# EAGLE design IO_board-ha-v4 (EAGLE 6.5.0)
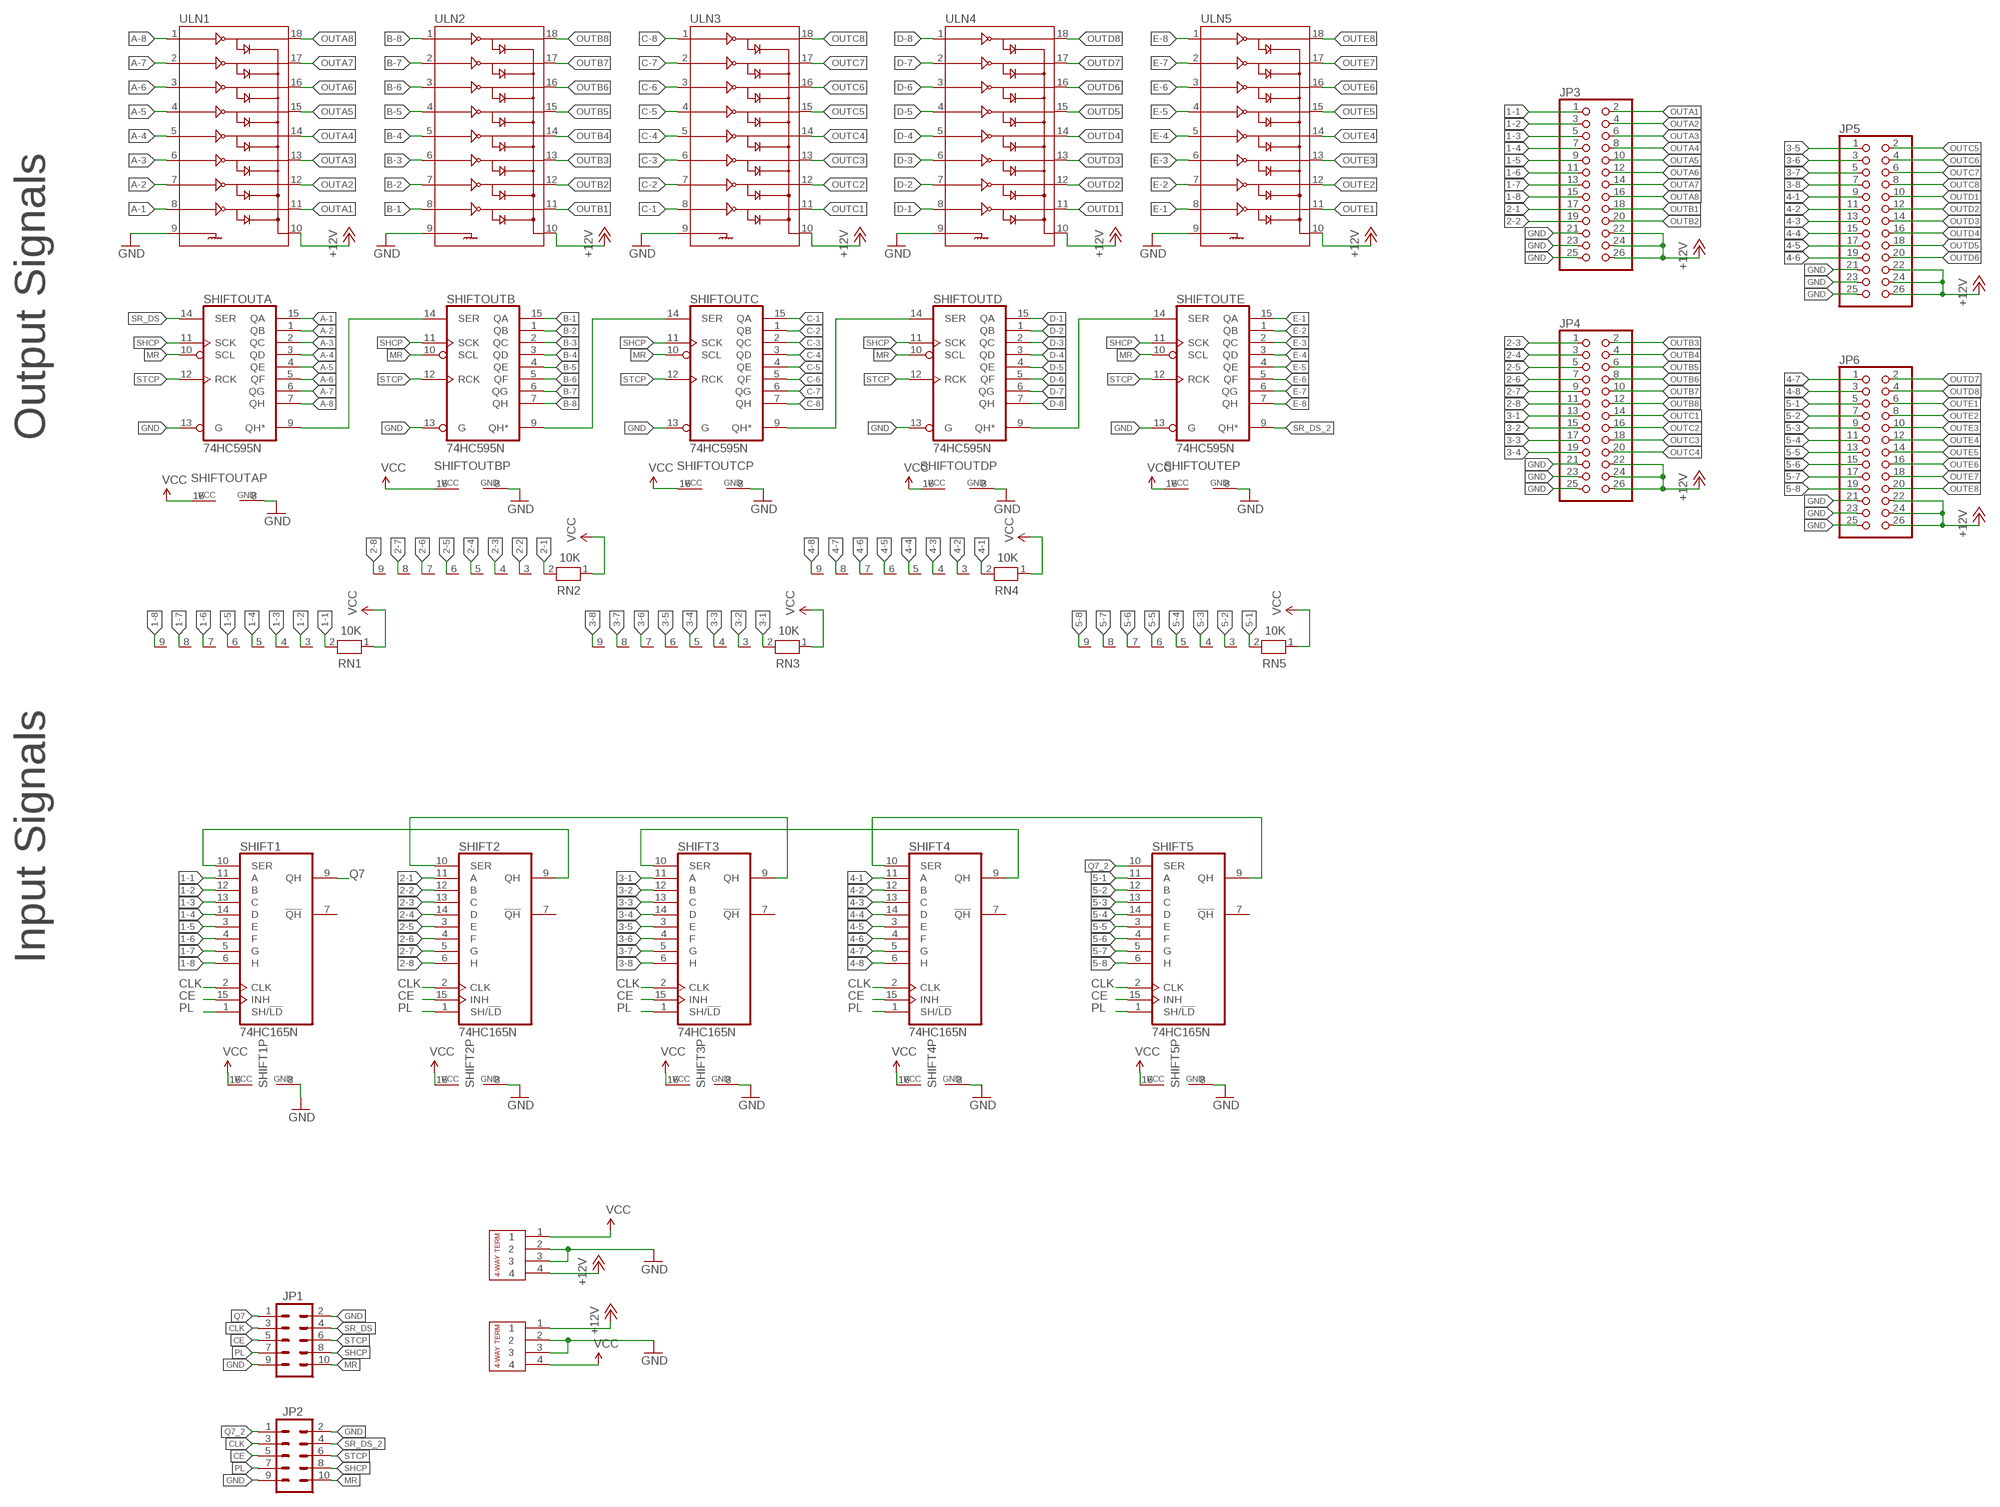
[diagram p0: schematic, sheet 1]

## Parts
J1  4-PIN-CON-1759017  [4-PIN-CON-1759017]
J2  4-PIN-CON-1759017  [4-PIN-CON-1759017]
JP1  M05X2SHD  [2X5-SHROUDED]
JP2  M05X2SHD  [2X5-SHROUDED]
JP3  PINHD-2X13  [2X13]
JP4  PINHD-2X13  [2X13]
JP5  PINHD-2X13  [2X13]
JP6  PINHD-2X13  [2X13]
RN1  10K  RN08  [RN-9]
RN2  10K  RN08  [RN-9]
RN3  10K  RN08  [RN-9]
RN4  10K  RN08  [RN-9]
RN5  10K  RN08  [RN-9]
SHIFT1  74HC165N  [DIL16]
SHIFT2  74HC165N  [DIL16]
SHIFT3  74HC165N  [DIL16]
SHIFT4  74HC165N  [DIL16]
SHIFT5  74HC165N  [DIL16]
SHIFTOUTA  74HC595N  [DIL16]
SHIFTOUTB  74HC595N  [DIL16]
SHIFTOUTC  74HC595N  [DIL16]
SHIFTOUTD  74HC595N  [DIL16]
SHIFTOUTE  74HC595N  [DIL16]
ULN1  ULN2803DIP  [DIL18]
ULN2  ULN2803DIP  [DIL18]
ULN3  ULN2803DIP  [DIL18]
ULN4  ULN2803DIP  [DIL18]
ULN5  ULN2803DIP  [DIL18]

## Nets
1-1: JP3.1 RN1.2 SHIFT1.11(A)
1-2: JP3.3 RN1.3 SHIFT1.12(B)
1-3: JP3.5 RN1.4 SHIFT1.13(C)
1-4: JP3.7 RN1.5 SHIFT1.14(D)
1-5: JP3.9 RN1.6 SHIFT1.3(E)
1-6: JP3.11 RN1.7 SHIFT1.4(F)
1-7: JP3.13 RN1.8 SHIFT1.5(G)
1-8: JP3.15 RN1.9 SHIFT1.6(H)
2-1: JP3.17 RN2.2 SHIFT2.11(A)
2-2: JP3.19 RN2.3 SHIFT2.12(B)
2-3: JP4.1 RN2.4 SHIFT2.13(C)
2-4: JP4.3 RN2.5 SHIFT2.14(D)
2-5: JP4.5 RN2.6 SHIFT2.3(E)
2-6: JP4.7 RN2.7 SHIFT2.4(F)
2-7: JP4.9 RN2.8 SHIFT2.5(G)
2-8: JP4.11 RN2.9 SHIFT2.6(H)
3-1: JP4.13 RN3.2 SHIFT3.11(A)
3-2: JP4.15 RN3.3 SHIFT3.12(B)
3-3: JP4.17 RN3.4 SHIFT3.13(C)
3-4: JP4.19 RN3.5 SHIFT3.14(D)
3-5: JP5.1 RN3.6 SHIFT3.3(E)
3-6: JP5.3 RN3.7 SHIFT3.4(F)
3-7: JP5.5 RN3.8 SHIFT3.5(G)
3-8: JP5.7 RN3.9 SHIFT3.6(H)
4-1: JP5.9 RN4.2 SHIFT4.11(A)
4-2: JP5.11 RN4.3 SHIFT4.12(B)
4-3: JP5.13 RN4.4 SHIFT4.13(C)
4-4: JP5.15 RN4.5 SHIFT4.14(D)
4-5: JP5.17 RN4.6 SHIFT4.3(E)
4-6: JP5.19 RN4.7 SHIFT4.4(F)
4-7: JP6.1 RN4.8 SHIFT4.5(G)
4-8: JP6.3 RN4.9 SHIFT4.6(H)
5-1: JP6.5 RN5.2 SHIFT5.11(A)
5-2: JP6.7 RN5.3 SHIFT5.12(B)
5-3: JP6.9 RN5.4 SHIFT5.13(C)
5-4: JP6.11 RN5.5 SHIFT5.14(D)
5-5: JP6.13 RN5.6 SHIFT5.3(E)
5-6: JP6.15 RN5.7 SHIFT5.4(F)
5-7: JP6.17 RN5.8 SHIFT5.5(G)
5-8: JP6.19 RN5.9 SHIFT5.6(H)
+12V [power]: J1.4 J2.1 JP3.22 JP3.24 JP3.26 JP4.22 JP4.24 JP4.26 JP5.22 JP5.24 JP5.26 JP6.22 JP6.24 JP6.26 ULN1.10 ULN2.10 ULN3.10 ULN4.10 ULN5.10
A-1: SHIFTOUTA.15(QA) ULN1.8
A-2: SHIFTOUTA.1(QB) ULN1.7
A-3: SHIFTOUTA.2(QC) ULN1.6
A-4: SHIFTOUTA.3(QD) ULN1.5
A-5: SHIFTOUTA.4(QE) ULN1.4
A-6: SHIFTOUTA.5(QF) ULN1.3
A-7: SHIFTOUTA.6(QG) ULN1.2
A-8: SHIFTOUTA.7(QH) ULN1.1
B-1: SHIFTOUTB.15(QA) ULN2.8
B-2: SHIFTOUTB.1(QB) ULN2.7
B-3: SHIFTOUTB.2(QC) ULN2.6
B-4: SHIFTOUTB.3(QD) ULN2.5
B-5: SHIFTOUTB.4(QE) ULN2.4
B-6: SHIFTOUTB.5(QF) ULN2.3
B-7: SHIFTOUTB.6(QG) ULN2.2
B-8: SHIFTOUTB.7(QH) ULN2.1
C-1: SHIFTOUTC.15(QA) ULN3.8
C-2: SHIFTOUTC.1(QB) ULN3.7
C-3: SHIFTOUTC.2(QC) ULN3.6
C-4: SHIFTOUTC.3(QD) ULN3.5
C-5: SHIFTOUTC.4(QE) ULN3.4
C-6: SHIFTOUTC.5(QF) ULN3.3
C-7: SHIFTOUTC.6(QG) ULN3.2
C-8: SHIFTOUTC.7(QH) ULN3.1
CE: JP1.5 JP2.5 SHIFT1.15(INH) SHIFT2.15(INH) SHIFT3.15(INH) SHIFT4.15(INH) SHIFT5.15(INH)
CLK: JP1.3 JP2.3 SHIFT1.2(CLK) SHIFT2.2(CLK) SHIFT3.2(CLK) SHIFT4.2(CLK) SHIFT5.2(CLK)
D-1: SHIFTOUTD.15(QA) ULN4.8
D-2: SHIFTOUTD.1(QB) ULN4.7
D-3: SHIFTOUTD.2(QC) ULN4.6
D-4: SHIFTOUTD.3(QD) ULN4.5
D-5: SHIFTOUTD.4(QE) ULN4.4
D-6: SHIFTOUTD.5(QF) ULN4.3
D-7: SHIFTOUTD.6(QG) ULN4.2
D-8: SHIFTOUTD.7(QH) ULN4.1
E-1: SHIFTOUTE.15(QA) ULN5.8
E-2: SHIFTOUTE.1(QB) ULN5.7
E-3: SHIFTOUTE.2(QC) ULN5.6
E-4: SHIFTOUTE.3(QD) ULN5.5
E-5: SHIFTOUTE.4(QE) ULN5.4
E-6: SHIFTOUTE.5(QF) ULN5.3
E-7: SHIFTOUTE.6(QG) ULN5.2
E-8: SHIFTOUTE.7(QH) ULN5.1
GND [GND]: J1.2 J1.3 J2.2 J2.3 JP1.2 JP1.9 JP2.2 JP2.9 JP3.21 JP3.23 JP3.25 JP4.21 JP4.23 JP4.25 JP5.21 JP5.23 JP5.25 JP6.21 JP6.23 JP6.25 SHIFT1.8(GND) SHIFT2.8(GND) SHIFT3.8(GND) SHIFT4.8(GND) SHIFT5.8(GND) SHIFTOUTA.8(GND) SHIFTOUTA.13(G) SHIFTOUTB.8(GND) SHIFTOUTB.13(G) SHIFTOUTC.8(GND) SHIFTOUTC.13(G) SHIFTOUTD.8(GND) SHIFTOUTD.13(G) SHIFTOUTE.8(GND) SHIFTOUTE.13(G) ULN1.9 ULN2.9 ULN3.9 ULN4.9 ULN5.9
MR [power]: JP1.10 JP2.10 SHIFTOUTA.10(SCL) SHIFTOUTB.10(SCL) SHIFTOUTC.10(SCL) SHIFTOUTD.10(SCL) SHIFTOUTE.10(SCL)
N$18: SHIFT2.10(SER) SHIFT3.9(QH)
N$21: SHIFT3.10(SER) SHIFT4.9(QH)
N$22: SHIFT4.10(SER) SHIFT5.9(QH)
N$26: SHIFTOUTA.9(QH*) SHIFTOUTB.14(SER)
N$31: SHIFTOUTC.9(QH*) SHIFTOUTD.14(SER)
N$37: SHIFTOUTB.9(QH*) SHIFTOUTC.14(SER)
N$38: SHIFTOUTD.9(QH*) SHIFTOUTE.14(SER)
N$50: SHIFT1.10(SER) SHIFT2.9(QH)
OUTA1: JP3.2 ULN1.11
OUTA2: JP3.4 ULN1.12
OUTA3: JP3.6 ULN1.13
OUTA4: JP3.8 ULN1.14
OUTA5: JP3.10 ULN1.15
OUTA6: JP3.12 ULN1.16
OUTA7: JP3.14 ULN1.17
OUTA8: JP3.16 ULN1.18
OUTB1: JP3.18 ULN2.11
OUTB2: JP3.20 ULN2.12
OUTB3: JP4.2 ULN2.13
OUTB4: JP4.4 ULN2.14
OUTB5: JP4.6 ULN2.15
OUTB6: JP4.8 ULN2.16
OUTB7: JP4.10 ULN2.17
OUTB8: JP4.12 ULN2.18
OUTC1: JP4.14 ULN3.11
OUTC2: JP4.16 ULN3.12
OUTC3: JP4.18 ULN3.13
OUTC4: JP4.20 ULN3.14
OUTC5: JP5.2 ULN3.15
OUTC6: JP5.4 ULN3.16
OUTC7: JP5.6 ULN3.17
OUTC8: JP5.8 ULN3.18
OUTD1: JP5.10 ULN4.11
OUTD2: JP5.12 ULN4.12
OUTD3: JP5.14 ULN4.13
OUTD4: JP5.16 ULN4.14
OUTD5: JP5.18 ULN4.15
OUTD6: JP5.20 ULN4.16
OUTD7: JP6.2 ULN4.17
OUTD8: JP6.4 ULN4.18
OUTE1: JP6.6 ULN5.11
OUTE2: JP6.8 ULN5.12
OUTE3: JP6.10 ULN5.13
OUTE4: JP6.12 ULN5.14
OUTE5: JP6.14 ULN5.15
OUTE6: JP6.16 ULN5.16
OUTE7: JP6.18 ULN5.17
OUTE8: JP6.20 ULN5.18
PL: JP1.7 JP2.7 SHIFT1.1(SH/!LD) SHIFT2.1(SH/!LD) SHIFT3.1(SH/!LD) SHIFT4.1(SH/!LD) SHIFT5.1(SH/!LD)
Q7: JP1.1 SHIFT1.9(QH)
Q7_2: JP2.1 SHIFT5.10(SER)
SHCP: JP1.8 JP2.8 SHIFTOUTA.11(SCK) SHIFTOUTB.11(SCK) SHIFTOUTC.11(SCK) SHIFTOUTD.11(SCK) SHIFTOUTE.11(SCK)
SR_DS: JP1.4 SHIFTOUTA.14(SER)
SR_DS_2: JP2.4 SHIFTOUTE.9(QH*)
STCP: JP1.6 JP2.6 SHIFTOUTA.12(RCK) SHIFTOUTB.12(RCK) SHIFTOUTC.12(RCK) SHIFTOUTD.12(RCK) SHIFTOUTE.12(RCK)
VCC [power]: J1.1 J2.4 RN1.1 RN2.1 RN3.1 RN4.1 RN5.1 SHIFT1.16(VCC) SHIFT2.16(VCC) SHIFT3.16(VCC) SHIFT4.16(VCC) SHIFT5.16(VCC) SHIFTOUTA.16(VCC) SHIFTOUTB.16(VCC) SHIFTOUTC.16(VCC) SHIFTOUTD.16(VCC) SHIFTOUTE.16(VCC)
Unconnected: SHIFT1.7(!QH) SHIFT2.7(!QH) SHIFT3.7(!QH) SHIFT4.7(!QH) SHIFT5.7(!QH)

## Notes on the sheet
- Output Signals
- Input Signals

## Library data of the parts
J1 J2 = maul:4-PIN-CON-1759017
JP1 JP2 = SparkFun-Connectors:M05X2: Header 5x2 Standard 10-pin dual row 0.1" header. Commonly used with AVR-ISP. Use with Spark Fun Electronics SKU: PRT-00778
JP3-JP6 = pinhead:PINHD-2X13: PIN HEADER
RN1-RN5 = resistor-net:RN08: RESISTOR NETWORK; OC_FARNELL: unknown; OC_NEWARK: unknown
SHIFT1-SHIFT5 = 74xx-eu:74*165: 8-bit parallel load SHIFT REGISTER
SHIFTOUTA SHIFTOUTB SHIFTOUTC SHIFTOUTD SHIFTOUTE = 74xx-eu:74*595: 8-bit SHIFT REGISTER, output latch
ULN1-ULN5 = SparkFun-PowerIC:ULN2803: Darlington Driver ULN2803 Darlington array. 500mA max per channel, 8-channel package. Spark Fun Electronics SKU : COM-00312

## Net classes
1 power: width 0.305 mm, drill 0.6 mm, clearance 0.813 mm
2 GND: width 0.305 mm, drill 0.6 mm, clearance 0.508 mm
3 LIVEAC: width 0.508 mm, drill 0.508 mm, clearance 1.27 mm

## Board
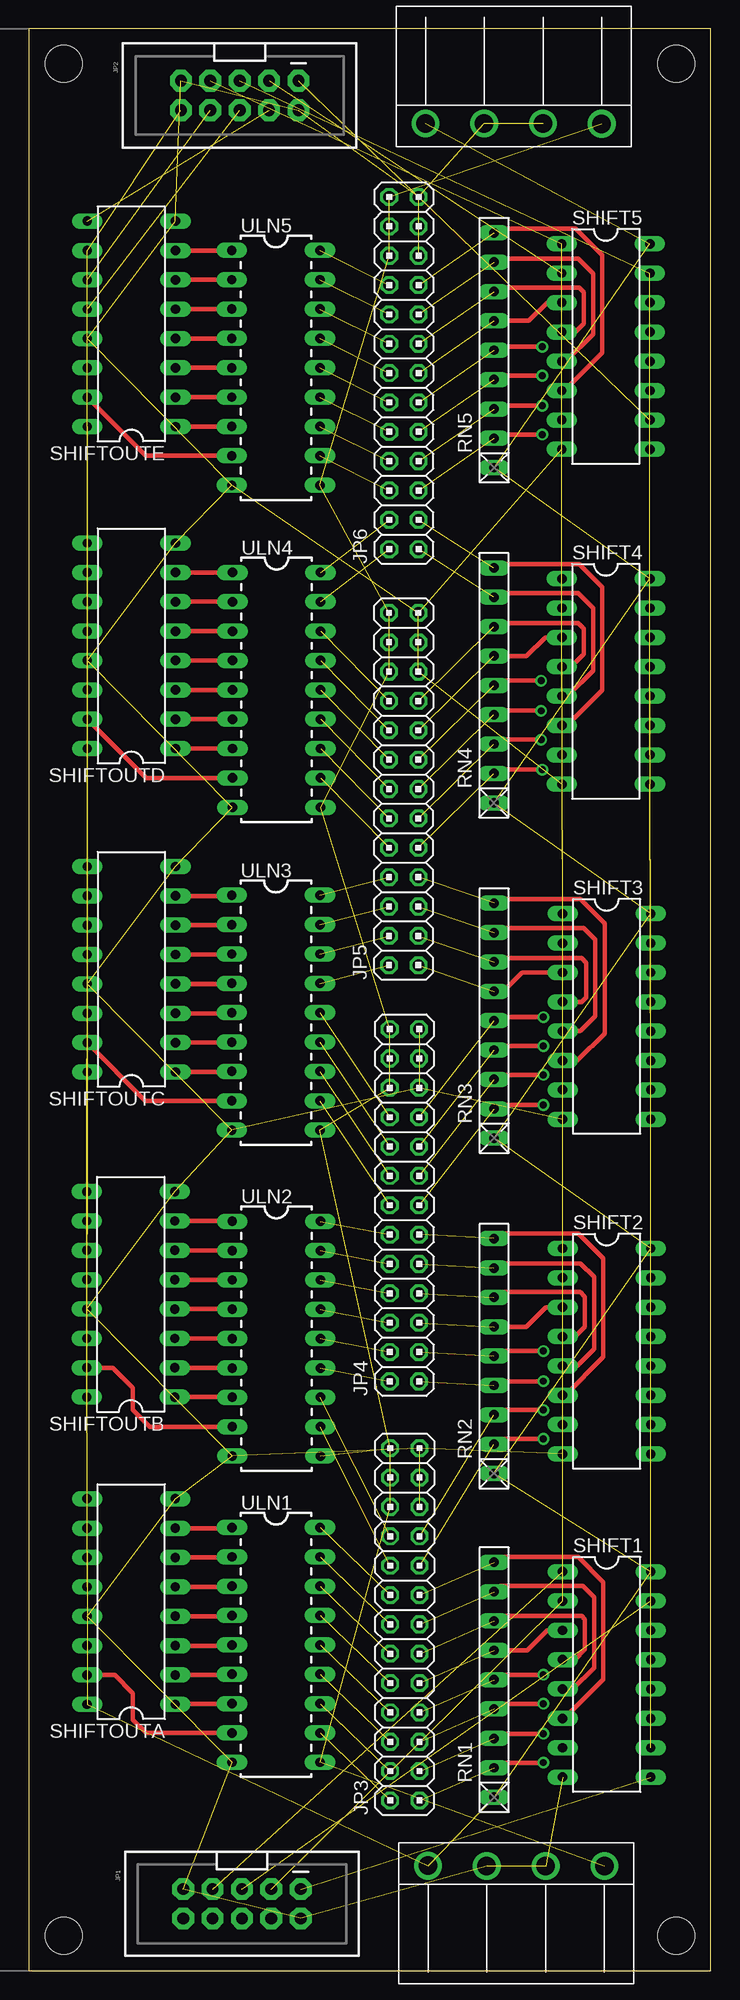
[diagram p1: board, top side]
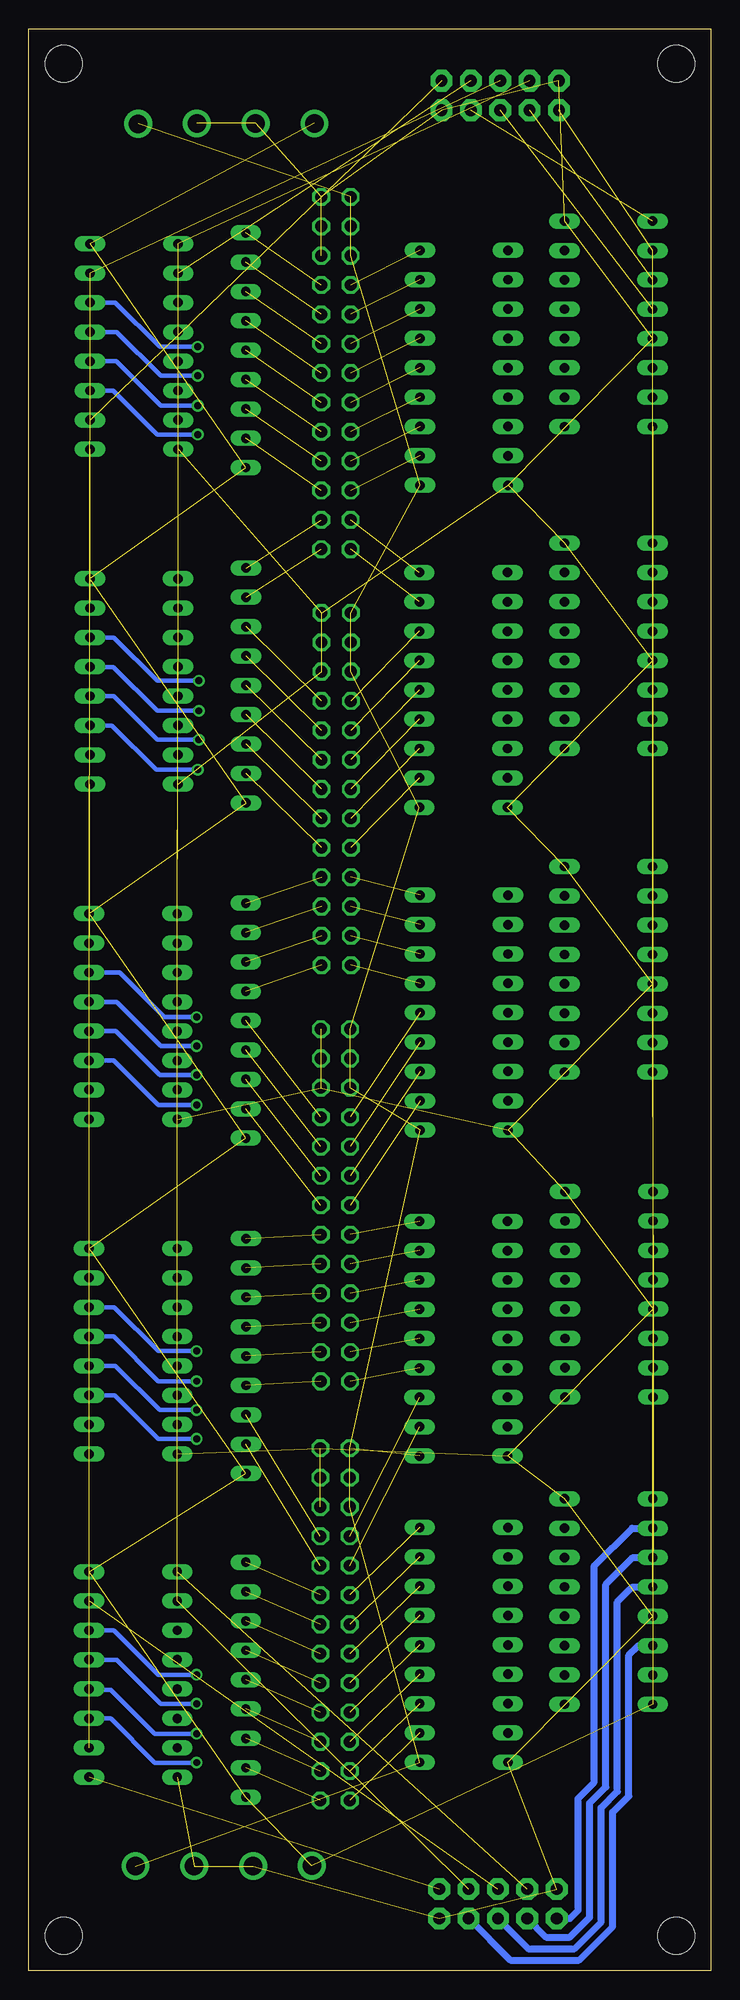
[diagram p2: board, bottom side, seen from below]

Size 59 x 168 mm. Coordinates in mm from the lower left corner, seen from the top.
Outline: 0,0 59,0 59,168 0,168 0,0
Copper layers (1*16): Top 0.035mm / dielectric 1.5mm / Bottom 0.035mm
Design rules "default": minimum track width 10mil, minimum drill 24mil, track to track 8mil, track to pad 8mil, pad to pad 8mil, via to via 8mil, smd to smd 8mil, copper to edge 40mil, drill to drill 8mil, minimum pad ring 10mil, minimum via ring 8mil, stop-mask expansion 4mil, vias tented up to drill 0mil, thermal gap 10mil
Holes 3.2 mm at 3,3 3,165 56,3 56,165

### Footprints (pad centres in the part's own frame; a part is rotated, then mirrored left to right if it is on the bottom)
4-PIN-CON-1759017 = drill 1.6: 1 -7.62,4.13; 2 -2.55,4.1; 3 2.55,4.1; 4 7.63,4.1
2X5-SHROUDED = drill 1.016 pad 1.88 octagon: 1 -1.27,5.08; 2 1.27,5.08; 3 -1.27,2.54; 4 1.27,2.54; 5 -1.27,0; 6 1.27,0; 7 -1.27,-2.54; 8 1.27,-2.54; 9 -1.27,-5.08; 10 1.27,-5.08
2X13 = drill 1.016 octagon: 1 -15.24,-1.27; 2 -15.24,1.27; 3 -12.7,-1.27; 4 -12.7,1.27; 5 -10.16,-1.27; 6 -10.16,1.27; 7 -7.62,-1.27; 8 -7.62,1.27; 9 -5.08,-1.27; 10 -5.08,1.27; 11 -2.54,-1.27; 12 -2.54,1.27; 13 0,-1.27; 14 0,1.27; 15 2.54,-1.27; 16 2.54,1.27; 17 5.08,-1.27; 18 5.08,1.27; 19 7.62,-1.27; 20 7.62,1.27; 21 10.16,-1.27; 22 10.16,1.27; 23 12.7,-1.27; 24 12.7,1.27; 25 15.24,-1.27; 26 15.24,1.27
RN-9 = drill 0.813 long: 1 -10.16,0; 2 -7.62,0; 3 -5.08,0; 4 -2.54,0; 5 0,0; 6 2.54,0; 7 5.08,0; 8 7.62,0; 9 10.16,0
DIL16 = drill 0.813 long: 1 -8.89,-3.81; 2 -6.35,-3.81; 3 -3.81,-3.81; 4 -1.27,-3.81; 5 1.27,-3.81; 6 3.81,-3.81; 7 6.35,-3.81; 8 8.89,-3.81; 9 8.89,3.81; 10 6.35,3.81; 11 3.81,3.81; 12 1.27,3.81; 13 -1.27,3.81; 14 -3.81,3.81; 15 -6.35,3.81; 16 -8.89,3.81
DIL18 = drill 0.813 long: 1 -10.16,-3.81; 2 -7.62,-3.81; 3 -5.08,-3.81; 4 -2.54,-3.81; 5 0,-3.81; 6 2.54,-3.81; 7 5.08,-3.81; 8 7.62,-3.81; 9 10.16,-3.81; 10 10.16,3.81; 11 7.62,3.81; 12 5.08,3.81; 13 2.54,3.81; 14 0,3.81; 15 -2.54,3.81; 16 -5.08,3.81; 17 -7.62,3.81; 18 -10.16,3.81

### Placement (x,y rotation side)
J1  42.15,4.94 0 top
J2  41.93,163.92 180 top
JP1  18.43,5.78 270 top
JP2  18.23,162.24 270 top
JP3  32.52,29.96 90 top
JP4  32.48,66.22 90 top
JP5  32.42,102.23 90 top
JP6  32.44,138.22 90 top
RN1  40.24,25.17 90 top
RN2  40.23,53.17 90 top
RN3  40.24,82.19 90 top
RN4  40.22,111.2 90 top
RN5  40.24,140.2 90 top
SHIFT1  49.98,25.63 270 top
SHIFT2  49.98,53.59 270 top
SHIFT3  49.98,82.55 270 top
SHIFT4  49.91,111.54 270 top
SHIFT5  49.9,140.51 270 top
SHIFTOUTA  8.85,31.93 90 top
SHIFTOUTB  8.81,58.51 90 top
SHIFTOUTC  8.86,86.64 90 top
SHIFTOUTD  8.86,114.62 90 top
SHIFTOUTE  8.86,142.48 90 top
ULN1  21.38,28.18 270 top
ULN2  21.4,54.68 270 top
ULN3  21.36,82.88 270 top
ULN4  21.42,110.81 270 top
ULN5  21.36,138.68 270 top

### Tracks (layer width: path | path; a pad name or v marks a point on that pad's centre or on a via)
1-1  (via drill 0.6)  (1 unrouted)
  Top 0.406: v44.5,18 40.69,18 RN1.2
  Bottom 0.406: SHIFT1.11 51.92,21.82 48.1,18 v44.5,18
1-2  (via drill 0.6)  (1 unrouted)
  Top 0.406: RN1.3 40.65,20.5 v44.5,20.5
  Bottom 0.406: v44.5,20.5 48.1,20.5 51.9,24.3 53.73,24.3 SHIFT1.12
1-3  (via drill 0.6)  (1 unrouted)
  Top 0.406: v44.5,23.1 40.71,23.1 RN1.4
  Bottom 0.406: SHIFT1.13 51.4,26.9 47.6,23.1 v44.5,23.1
1-4  (via drill 0.6)  (1 unrouted)
  Top 0.406: RN1.5 40.67,25.6 v44.5,25.6
  Bottom 0.406: v44.5,25.6 47.8,25.6 51.64,29.44 SHIFT1.14
1-5  (1 unrouted)
  Top 0.406: SHIFT1.3 44.84,29.44 43.1,27.7 RN1.6
1-6  (1 unrouted)
  Top 0.406: SHIFT1.4 47.2,26.9 48.1,27.8 48.1,30.4 47.8,30.7 40.69,30.7 RN1.7
1-7  (1 unrouted)
  Top 0.406: SHIFT1.5 47.06,24.36 48.9,26.2 48.9,32.3 47.9,33.3 40.75,33.3 RN1.8
1-8  (1 unrouted)
  Top 0.406: SHIFT1.6 46.32,21.82 49.7,25.2 49.7,33.6 47.5,35.8 40.71,35.8 RN1.9
2-1  (via drill 0.6)  (1 unrouted)
  Top 0.406: RN2.2 40.68,46 v44.5,46
  Bottom 0.406: v44.5,46 47.8,46 51.58,49.78 SHIFT2.11
2-2  (via drill 0.6)  (1 unrouted)
  Top 0.406: v44.5,48.5 40.64,48.5 RN2.3
  Bottom 0.406: SHIFT2.12 51.52,52.32 47.7,48.5 v44.5,48.5
2-3  (via drill 0.6)  (1 unrouted)
  Top 0.406: v44.5,51 40.6,51 RN2.4
  Bottom 0.406: SHIFT2.13 51.66,54.86 47.8,51 v44.5,51
2-4  (via drill 0.6)  (1 unrouted)
  Top 0.406: v44.5,53.6 40.66,53.6 RN2.5
  Bottom 0.406: SHIFT2.14 51.6,57.4 47.8,53.6 v44.5,53.6
2-5  (1 unrouted)
  Top 0.406: SHIFT2.3 44.7,57.4 43,55.7 RN2.6
2-6  (1 unrouted)
  Top 0.406: SHIFT2.4 47.26,54.86 48.1,55.7 48.1,58.3 47.7,58.7 40.68,58.7 RN2.7
2-7  (1 unrouted)
  Top 0.406: SHIFT2.5 47.42,52.32 48.9,53.8 48.9,60 47.7,61.2 40.64,61.2 RN2.8
2-8  (1 unrouted)
  Top 0.406: SHIFT2.6 46.38,49.78 49.7,53.1 49.7,61.6 47.5,63.8 40.7,63.8 RN2.9
3-1  (via drill 0.6)  (1 unrouted)
  Top 0.406: v44.5,74.9 40.57,74.9 RN3.2
  Bottom 0.406: SHIFT3.11 51.64,78.74 47.8,74.9 v44.5,74.9
3-2  (via drill 0.6)  (1 unrouted)
  Top 0.406: v44.5,77.5 40.63,77.5 RN3.3
  Bottom 0.406: SHIFT3.12 51.48,81.28 47.7,77.5 v44.5,77.5
3-3  (via drill 0.6)  (1 unrouted)
  Top 0.406: v44.5,80 40.59,80 RN3.4
  Bottom 0.406: SHIFT3.13 51.42,83.82 47.6,80 v44.5,80
3-4  (via drill 0.6)  (1 unrouted)
  Top 0.406: v44.5,82.5 40.55,82.5 RN3.5
  Bottom 0.406: SHIFT3.14 51.16,86.36 47.3,82.5 v44.5,82.5
3-5  (1 unrouted)
  Top 0.406: SHIFT3.3 42.66,86.36 41.03,84.73 RN3.6
3-6  (1 unrouted)
  Top 0.406: SHIFT3.4 47.82,83.82 48.2,84.2 48.2,87.2 47.8,87.6 40.57,87.6 RN3.7
3-7  (1 unrouted)
  Top 0.406: SHIFT3.5 47.68,81.28 49,82.6 49,89.2 48,90.2 40.63,90.2 RN3.8
3-8  (1 unrouted)
  Top 0.406: SHIFT3.6 47.44,78.74 49.8,81.1 49.8,90.6 47.7,92.7 40.59,92.7 RN3.9
4-1  (via drill 0.6)  (1 unrouted)
  Top 0.406: RN4.2 40.54,103.9 v44.4,103.9
  Bottom 0.406: v44.4,103.9 48,103.9 51.83,107.73 SHIFT4.11
4-2  (via drill 0.6)  (1 unrouted)
  Top 0.406: v44.3,106.5 40.6,106.5 RN4.3
  Bottom 0.406: SHIFT4.12 51.67,110.27 47.9,106.5 v44.3,106.5
4-3  (via drill 0.6)  (1 unrouted)
  Top 0.406: RN4.4 40.56,109 v44.3,109
  Bottom 0.406: v44.3,109 47.9,109 51.7,112.8 SHIFT4.13
4-4  (via drill 0.6)  (1 unrouted)
  Top 0.406: v44.3,111.6 40.62,111.6 RN4.5
  Bottom 0.406: SHIFT4.14 51.65,115.35 47.9,111.6 v44.3,111.6
4-5  (1 unrouted)
  Top 0.406: SHIFT4.3 44.65,115.35 43.04,113.74 RN4.6
4-6  (1 unrouted)
  Top 0.406: SHIFT4.4 46.91,112.81 48,113.9 48,116.1 47.5,116.6 40.54,116.6 RN4.7
4-7  (1 unrouted)
  Top 0.406: SHIFT4.5 46.57,110.27 48.8,112.5 48.8,117.9 47.5,119.2 40.6,119.2 RN4.8
4-8  (1 unrouted)
  Top 0.406: SHIFT4.6 46.53,107.73 49.6,110.8 49.6,119.7 47.6,121.7 40.56,121.7 RN4.9
5-1  (via drill 0.6)  (1 unrouted)
  Top 0.406: v44.4,132.9 40.56,132.9 RN5.2
  Bottom 0.406: SHIFT5.11 51.7,136.7 47.9,132.9 v44.4,132.9
5-2  (via drill 0.6)  (1 unrouted)
  Top 0.406: v44.4,135.4 40.52,135.4 RN5.3
  Bottom 0.406: SHIFT5.12 51.44,139.24 47.6,135.4 v44.4,135.4
5-3  (via drill 0.6)  (1 unrouted)
  Top 0.406: v44.4,138 40.58,138 RN5.4
  Bottom 0.406: SHIFT5.13 51.38,141.78 47.6,138 v44.4,138
5-4  (via drill 0.6)  (1 unrouted)
  Top 0.406: v44.4,140.5 40.54,140.5 RN5.5
  Bottom 0.406: SHIFT5.14 51.52,144.32 47.7,140.5 v44.4,140.5
5-5  (1 unrouted)
  Top 0.406: SHIFT5.3 44.82,144.32 43.24,142.74 RN5.6
5-6  (1 unrouted)
  Top 0.406: SHIFT5.4 47.28,141.78 48,142.5 48,145.2 47.6,145.6 40.56,145.6 RN5.7
5-7  (1 unrouted)
  Top 0.406: SHIFT5.5 46.44,139.24 48.8,141.6 48.8,146.8 47.5,148.1 40.52,148.1 RN5.8
5-8  (1 unrouted)
  Top 0.406: SHIFT5.6 46.3,136.7 49.6,140 49.6,148.4 47.3,150.7 40.58,150.7 RN5.9
+12V  (18 unrouted)
A-1
  Top 0.406: SHIFTOUTA.15 7.42,25.58 9,24 9,21.7 10.14,20.56 ULN1.8
A-2
  Top 0.406: SHIFTOUTA.1 12.72,23.1 ULN1.7
A-3
  Top 0.406: SHIFTOUTA.2 17.51,25.58 ULN1.6
A-4
  Top 0.406: SHIFTOUTA.3 17.51,28.12 ULN1.5
A-5
  Top 0.406: SHIFTOUTA.4 17.51,30.66 ULN1.4
A-6
  Top 0.406: SHIFTOUTA.5 17.51,33.2 ULN1.3
A-7
  Top 0.406: SHIFTOUTA.6 17.51,35.74 ULN1.2
A-8
  Top 0.406: SHIFTOUTA.7 17.51,38.28 ULN1.1
B-1
  Top 0.406: SHIFTOUTB.15 7.24,52.16 9,50.4 9,48.5 10.44,47.06 ULN2.8
B-2
  Top 0.406: SHIFTOUTB.1 17.57,49.62 ULN2.7
B-3
  Top 0.406: SHIFTOUTB.2 17.57,52.16 ULN2.6
B-4
  Top 0.406: SHIFTOUTB.3 17.57,54.7 ULN2.5
B-5
  Top 0.406: SHIFTOUTB.4 17.57,57.24 ULN2.4
B-6
  Top 0.406: SHIFTOUTB.5 17.57,59.78 ULN2.3
B-7
  Top 0.406: SHIFTOUTB.6 17.57,62.32 ULN2.2
B-8
  Top 0.406: SHIFTOUTB.7 17.57,64.86 ULN2.1
C-1
  Top 0.406: SHIFTOUTC.15 10.08,75.26 ULN3.8
C-2
  Top 0.406: SHIFTOUTC.1 17.5,77.75 ULN3.7
C-3
  Top 0.406: SHIFTOUTC.2 17.5,80.29 ULN3.6
C-4
  Top 0.406: SHIFTOUTC.3 17.5,82.83 ULN3.5
C-5
  Top 0.406: SHIFTOUTC.4 17.5,85.37 ULN3.4
C-6
  Top 0.406: SHIFTOUTC.5 17.5,87.91 ULN3.3
C-7
  Top 0.406: SHIFTOUTC.6 17.5,90.45 ULN3.2
C-8
  Top 0.406: SHIFTOUTC.7 17.5,92.99 ULN3.1
CE  (6 unrouted)
CLK  (6 unrouted)
D-1
  Top 0.406: SHIFTOUTD.15 10.13,103.19 ULN4.8
D-2
  Top 0.406: SHIFTOUTD.1 ULN4.7
D-3
  Top 0.406: SHIFTOUTD.2 ULN4.6
D-4
  Top 0.406: SHIFTOUTD.3 ULN4.5
D-5
  Top 0.406: SHIFTOUTD.4 ULN4.4
D-6
  Top 0.406: SHIFTOUTD.5 ULN4.3
D-7
  Top 0.406: SHIFTOUTD.6 ULN4.2
D-8
  Top 0.406: SHIFTOUTD.7 ULN4.1
E-1
  Top 0.406: SHIFTOUTE.15 10.12,131.06 ULN5.8
E-2
  Top 0.406: SHIFTOUTE.1 ULN5.7
E-3
  Top 0.406: SHIFTOUTE.2 ULN5.6
E-4
  Top 0.406: SHIFTOUTE.3 ULN5.5
E-5
  Top 0.406: SHIFTOUTE.4 ULN5.4
E-6
  Top 0.406: SHIFTOUTE.5 ULN5.3
E-7
  Top 0.406: SHIFTOUTE.6 ULN5.2
E-8
  Top 0.406: SHIFTOUTE.7 ULN5.1
GND  (39 unrouted)
MR  (5 unrouted)
  Bottom 0.61: JP1.10 12.19,4.51 11.5,5.2 11.5,14.9 10.1,16.3 10.1,35 6.82,38.28 SHIFTOUTA.10
N$18  (1 unrouted)
N$21  (1 unrouted)
N$22  (1 unrouted)
N$26  (1 unrouted)
N$31  (1 unrouted)
N$37  (1 unrouted)
N$38  (1 unrouted)
N$50  (1 unrouted)
OUTA1  (1 unrouted)
OUTA2  (1 unrouted)
OUTA3  (1 unrouted)
OUTA4  (1 unrouted)
OUTA5  (1 unrouted)
OUTA6  (1 unrouted)
OUTA7  (1 unrouted)
OUTA8  (1 unrouted)
OUTB1  (1 unrouted)
OUTB2  (1 unrouted)
OUTB3  (1 unrouted)
OUTB4  (1 unrouted)
OUTB5  (1 unrouted)
OUTB6  (1 unrouted)
OUTB7  (1 unrouted)
OUTB8  (1 unrouted)
OUTC1  (1 unrouted)
OUTC2  (1 unrouted)
OUTC3  (1 unrouted)
OUTC4  (1 unrouted)
OUTC5  (1 unrouted)
OUTC6  (1 unrouted)
OUTC7  (1 unrouted)
OUTC8  (1 unrouted)
OUTD1  (1 unrouted)
OUTD2  (1 unrouted)
OUTD3  (1 unrouted)
OUTD4  (1 unrouted)
OUTD5  (1 unrouted)
OUTD6  (1 unrouted)
OUTD7  (1 unrouted)
OUTD8  (1 unrouted)
OUTE1  (1 unrouted)
OUTE2  (1 unrouted)
OUTE3  (1 unrouted)
OUTE4  (1 unrouted)
OUTE5  (1 unrouted)
OUTE6  (1 unrouted)
OUTE7  (1 unrouted)
OUTE8  (1 unrouted)
PL  (6 unrouted)
Q7  (1 unrouted)
Q7_2  (1 unrouted)
SHCP  (5 unrouted)
  Bottom 0.61: JP1.8 14.28,2.9 12.2,2.9 10.5,4.6 10.5,14.5 9.1,15.9 9.1,33.4 6.76,35.74 SHIFTOUTA.11
SR_DS
  Bottom 0.61: JP1.4 17.36,0.9 11.4,0.9 8.5,3.8 8.5,13.7 7.1,15.1 7.1,27.3 6.28,28.12 SHIFTOUTA.14
SR_DS_2  (1 unrouted)
STCP  (5 unrouted)
  Bottom 0.61: JP1.6 15.82,1.9 11.8,1.9 9.5,4.2 9.5,14.1 8.1,15.5 8.1,31.9 6.8,33.2 SHIFTOUTA.12
VCC  (16 unrouted)